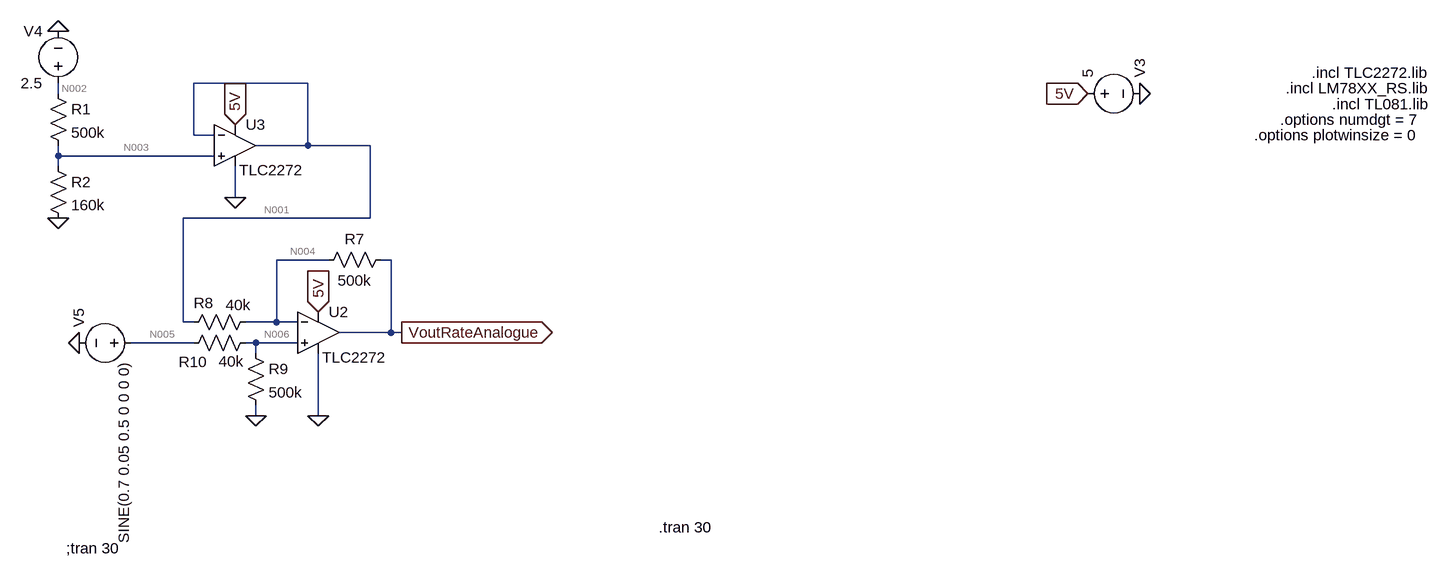
[diagram p0: schematic Draft1.asc]
Draft1.asc, the LTspice schematic file:
Version 4
SHEET 1 1088 680
WIRE -656 -192 -832 -192
WIRE -1040 -176 -1040 -192
WIRE -832 -112 -832 -192
WIRE -800 -112 -832 -112
WIRE -656 -96 -656 -192
WIRE -656 -96 -736 -96
WIRE -560 -96 -656 -96
WIRE -1040 -80 -1040 -96
WIRE -800 -80 -1040 -80
WIRE -1040 -64 -1040 -80
WIRE -768 -16 -768 -64
WIRE -560 16 -560 -96
WIRE -560 16 -848 16
WIRE -624 80 -704 80
WIRE -528 80 -544 80
WIRE -848 176 -848 16
WIRE -832 176 -848 176
WIRE -704 176 -704 80
WIRE -704 176 -752 176
WIRE -672 176 -704 176
WIRE -528 192 -528 80
WIRE -528 192 -608 192
WIRE -512 192 -528 192
WIRE -832 208 -928 208
WIRE -736 208 -752 208
WIRE -672 208 -736 208
WIRE -736 224 -736 208
WIRE -736 320 -736 304
WIRE -640 320 -640 224
FLAG 624 -176 0
FLAG 544 -176 5V
IOPIN 544 -176 In
FLAG -640 320 0
FLAG -736 320 0
FLAG -640 160 5V
IOPIN -640 160 In
FLAG -512 192 VoutRateAnalogue
IOPIN -512 192 Out
FLAG -1008 208 0
FLAG -768 -16 0
FLAG -768 -128 5V
IOPIN -768 -128 In
FLAG -1040 -272 0
FLAG -1040 16 0
SYMBOL voltage 528 -176 R270
WINDOW 0 24 96 Left 2
WINDOW 3 24 16 Left 2
WINDOW 123 0 0 Left 0
WINDOW 39 0 0 Left 0
SYMATTR InstName V3
SYMATTR Value 5
SYMBOL res -528 64 R90
WINDOW 0 0 56 VBottom 2
WINDOW 3 32 56 VTop 2
SYMATTR InstName R7
SYMATTR Value 500k
SYMBOL res -736 160 R90
WINDOW 0 2 80 VBottom 2
WINDOW 3 -26 27 VTop 2
SYMATTR InstName R8
SYMATTR Value 40k
SYMBOL Opamps\\opamp2 -640 128 R0
WINDOW 3 6 102 Left 2
SYMATTR Value TLC2272
SYMATTR InstName U2
SYMBOL res -752 208 R0
SYMATTR InstName R9
SYMATTR Value 500k
SYMBOL res -736 192 R90
WINDOW 0 61 97 VBottom 2
WINDOW 3 29 38 VTop 2
SYMATTR InstName R10
SYMATTR Value 40k
SYMBOL voltage -912 208 M270
WINDOW 0 24 96 Left 2
WINDOW 3 -309 27 Left 2
WINDOW 123 0 0 Left 0
WINDOW 39 0 0 Left 0
SYMATTR InstName V5
SYMATTR Value SINE(0.7 0.05 0.5 0 0 0 0)
SYMBOL Opamps\\opamp2 -768 -160 R0
WINDOW 3 6 102 Left 2
SYMATTR Value TLC2272
SYMATTR InstName U3
SYMBOL voltage -1040 -176 R180
WINDOW 0 24 96 Left 2
WINDOW 3 24 16 Left 2
WINDOW 123 0 0 Left 0
WINDOW 39 0 0 Left 0
SYMATTR InstName V4
SYMATTR Value 2.5
SYMBOL res -1056 -192 R0
SYMATTR InstName R1
SYMATTR Value 500k
SYMATTR SpiceLine tol=60k
SYMBOL res -1056 -80 R0
SYMATTR InstName R2
SYMATTR Value 160k
TEXT 888 -208 Left 2 !.incl TLC2272.lib
TEXT 848 -184 Left 2 !.incl LM78XX_RS.lib
TEXT 920 -160 Left 2 !.incl TL081.lib
TEXT 840 -136 Left 2 !.options numdgt = 7
TEXT 800 -112 Left 2 !.options plotwinsize = 0
TEXT -116 492 Left 2 !.tran 30
TEXT -1028 524 Left 2 !;tran 30

The netlist it stands for:
* Draft1.asc
V3 5V 0 5
R7 VoutRateAnalogue N004 500k
R8 N004 N001 40k
XU2 N006 N004 5V 0 VoutRateAnalogue TLC2272  ; pins In+ In- V+ V- OUT
R9 N006 0 500k
R10 N006 N005 40k
V5 N005 0 SINE(0.7 0.05 0.5 0 0 0 0)
XU3 N003 N001 5V 0 N001 TLC2272  ; pins In+ In- V+ V- OUT
V4 N002 0 2.5
R1 N002 N003 500k tol=60k
R2 N003 0 160k
.incl TLC2272.lib
.incl LM78XX_RS.lib
.incl TL081.lib
.options numdgt = 7
.options plotwinsize = 0
.tran 30
;tran 30
.backanno
.end

* Results of the author's LTspice run, read from the files saved beside the schematic
* Operating Point, zero values left out:
*   V(5v) = 5 V
*   V(voutrateanalogue) = 1.174 V
*   V(n004) = 648.2 mV
*   V(n001) = 606.1 mV
*   V(n006) = 648.1 mV
*   V(n005) = 700 mV
*   V(n003) = 606.1 mV
*   V(n002) = 2.5 V
*   I(R2) = 3.788 µA
*   I(R1) = 3.788 µA
*   I(R10) = -1.296 µA
*   I(R9) = 1.296 µA
*   I(R8) = 1.052 µA
*   I(R7) = 1.052 µA
*   I(V4) = -3.788 µA
*   I(V5) = -1.296 µA
*   I(V3) = -4.801 mA
*   Ix(u2:IN+) = -8.205 pA
*   Ix(u2:IN-) = -8.76 pA
*   Ix(u2:VCC) = 2.401 mA
*   Ix(u2:VEE) = -2.4 mA
*   Ix(u2:OUT) = -1.052 µA
*   Ix(u3:IN+) = -8.415 pA
*   Ix(u3:IN-) = -8.971 pA
*   Ix(u3:VCC) = 2.4 mA
*   Ix(u3:VEE) = -2.401 mA
*   Ix(u3:OUT) = 1.052 µA
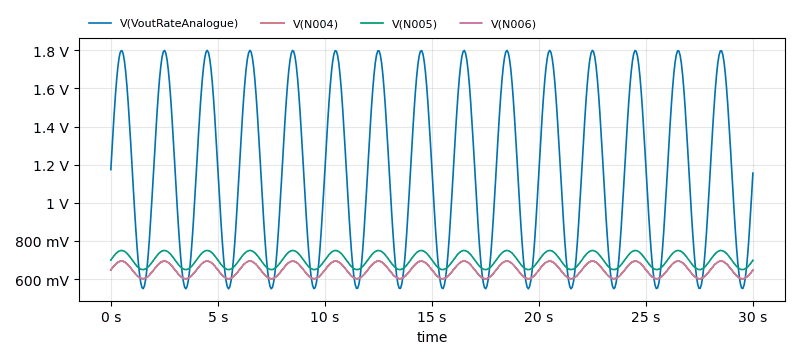
[diagram p1: Transient Analysis of Draft1.asc, plotted from the saved traces]
* Transient Analysis, 1 run:
*   V(VoutRateAnalogue): min 549.3 mV, max 1.799 V, average 1.174 V, rms 1.255 V, last 1.174 V
*   V(N004): min 602 mV, max 694.4 mV, average 648.2 mV, rms 649 mV, last 648.2 mV
*   V(N005): min 650 mV, max 750 mV, average 700 mV, rms 700.9 mV, last 700 mV
*   V(N006): min 602 mV, max 694.3 mV, average 648.1 mV, rms 649 mV, last 648.1 mV